# EAGLE schematic 4-voice(1_1) (EAGLE 9.2.1)

## Sheet 1 of 3
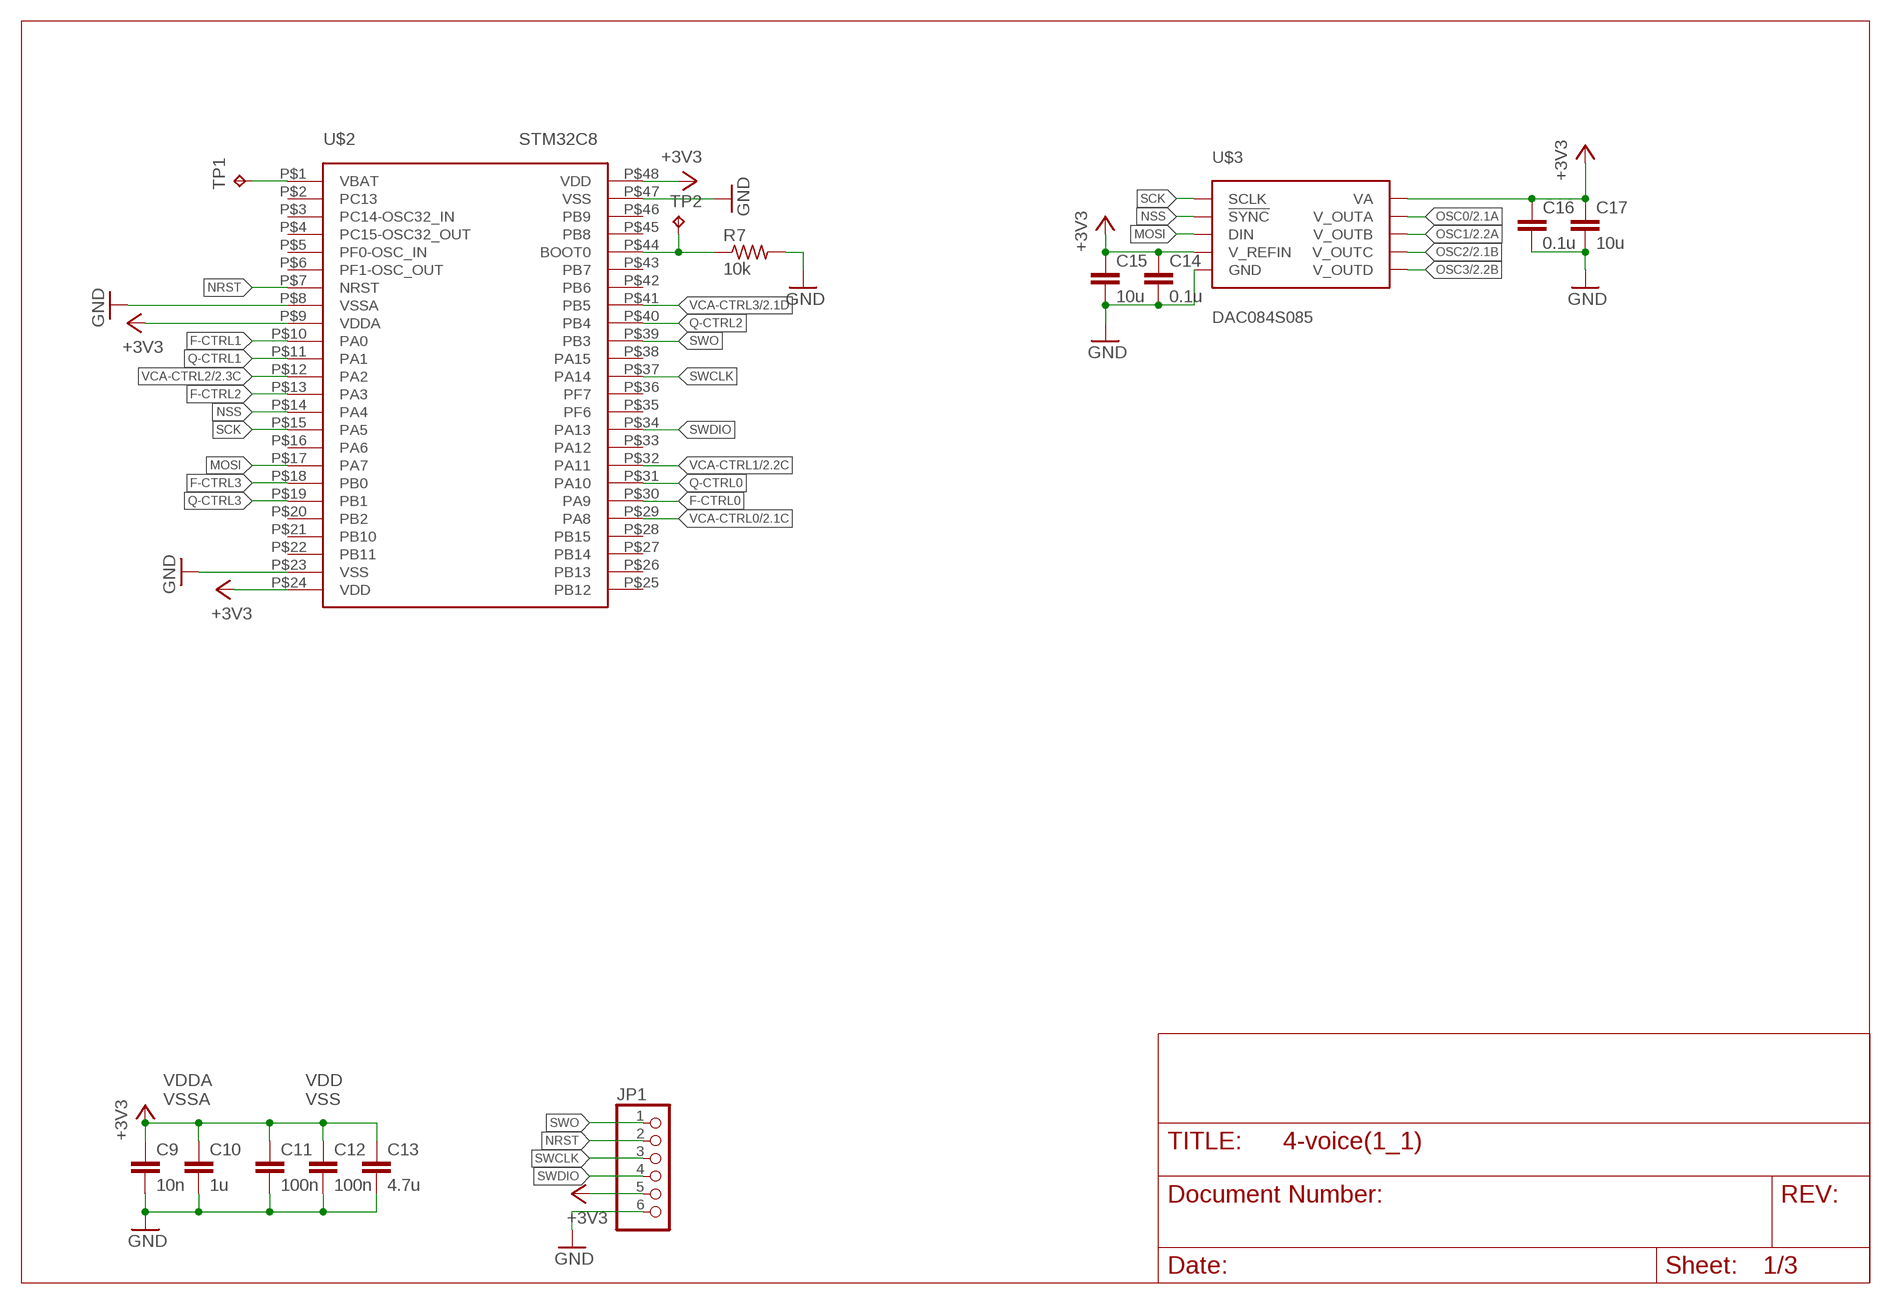
[diagram p0: schematic, sheet 1]

### Parts
C9  10n  C-EUC1206  [C1206]
C10  1u  C-EUC1206  [C1206]
C11  100n  C-EUC1206  [C1206]
C12  100n  C-EUC1206  [C1206]
C13  4.7u  C-EUC1206  [C1206]
C14  0.1u  C-EUC1206  [C1206]
C15  10u  C-EUC1206  [C1206]
C16  0.1u  C-EUC1206  [C1206]
C17  10u  C-EUC1206  [C1206]
JP1  PINHD-1X6  [1X06]
R7  10k  R-US_R1206  [R1206]
TP1  TPPAD1-13  [P1-13]
TP2  TPPAD1-13  [P1-13]
U$2  STM32C8  [LQFP48]
U$3  DAC084S085  [VSSOP10]

### Nets
+3V3: C9.1 C10.1 C11.1 C12.1 C13.1 C14.1 C15.1 C16.1 C17.1 JP1.5 U$2.P$9(VDDA) U$2.P$24(VDD) U$2.P$48(VDD) U$3.P$1(VA) U$3.P$7(V_REFIN)
F-CTRL0: U$2.P$30(PA9)
F-CTRL1: U$2.P$10(PA0)
F-CTRL2: U$2.P$13(PA3)
F-CTRL3: U$2.P$18(PB0)
GND: C9.2 C10.2 C11.2 C12.2 C13.2 C14.2 C15.2 C16.2 C17.2 JP1.6 R7.2 U$2.P$8(VSSA) U$2.P$23(VSS) U$2.P$47(VSS) U$3.P$6(GND) ; also sheet 2,3
MOSI: U$2.P$17(PA7) U$3.P$8(DIN)
N$7: TP1.TP U$2.P$1(VBAT)
N$8: R7.1 TP2.TP U$2.P$44(BOOT0)
NRST: JP1.2 U$2.P$7(NRST)
NSS: U$2.P$14(PA4) U$3.P$9(!SYNC)
OSC0: U$3.P$2(V_OUTA) ; also sheet 2
OSC1: U$3.P$3(V_OUTB) ; also sheet 2
OSC2: U$3.P$4(V_OUTC) ; also sheet 2
OSC3: U$3.P$5(V_OUTD) ; also sheet 2
Q-CTRL0: U$2.P$31(PA10)
Q-CTRL1: U$2.P$11(PA1)
Q-CTRL2: U$2.P$40(PB4)
Q-CTRL3: U$2.P$19(PB1)
SCK: U$2.P$15(PA5) U$3.P$10(SCLK)
SWCLK: JP1.3 U$2.P$37(PA14)
SWDIO: JP1.4 U$2.P$34(PA13)
SWO: JP1.1 U$2.P$39(PB3)
VCA-CTRL0: U$2.P$29(PA8) ; also sheet 2
VCA-CTRL1: U$2.P$32(PA11) ; also sheet 2
VCA-CTRL2: U$2.P$12(PA2) ; also sheet 2
VCA-CTRL3: U$2.P$41(PB5) ; also sheet 2
Unconnected: U$2.P$2(PC13) U$2.P$3(PC14-OSC32_IN) U$2.P$4(PC15-OSC32_OUT) U$2.P$5(PF0-OSC_IN) U$2.P$6(PF1-OSC_OUT) U$2.P$16(PA6) U$2.P$20(PB2) U$2.P$21(PB10) U$2.P$22(PB11) U$2.P$25(PB12) U$2.P$26(PB13) U$2.P$27(PB14) U$2.P$28(PB15) U$2.P$33(PA12) U$2.P$35(PF6) U$2.P$36(PF7) U$2.P$38(PA15) U$2.P$42(PB6) U$2.P$43(PB7) U$2.P$45(PB8) U$2.P$46(PB9)

### Notes on the sheet
- VDDA
  VSSA
- VDD
  VSS

## Sheet 2 of 3
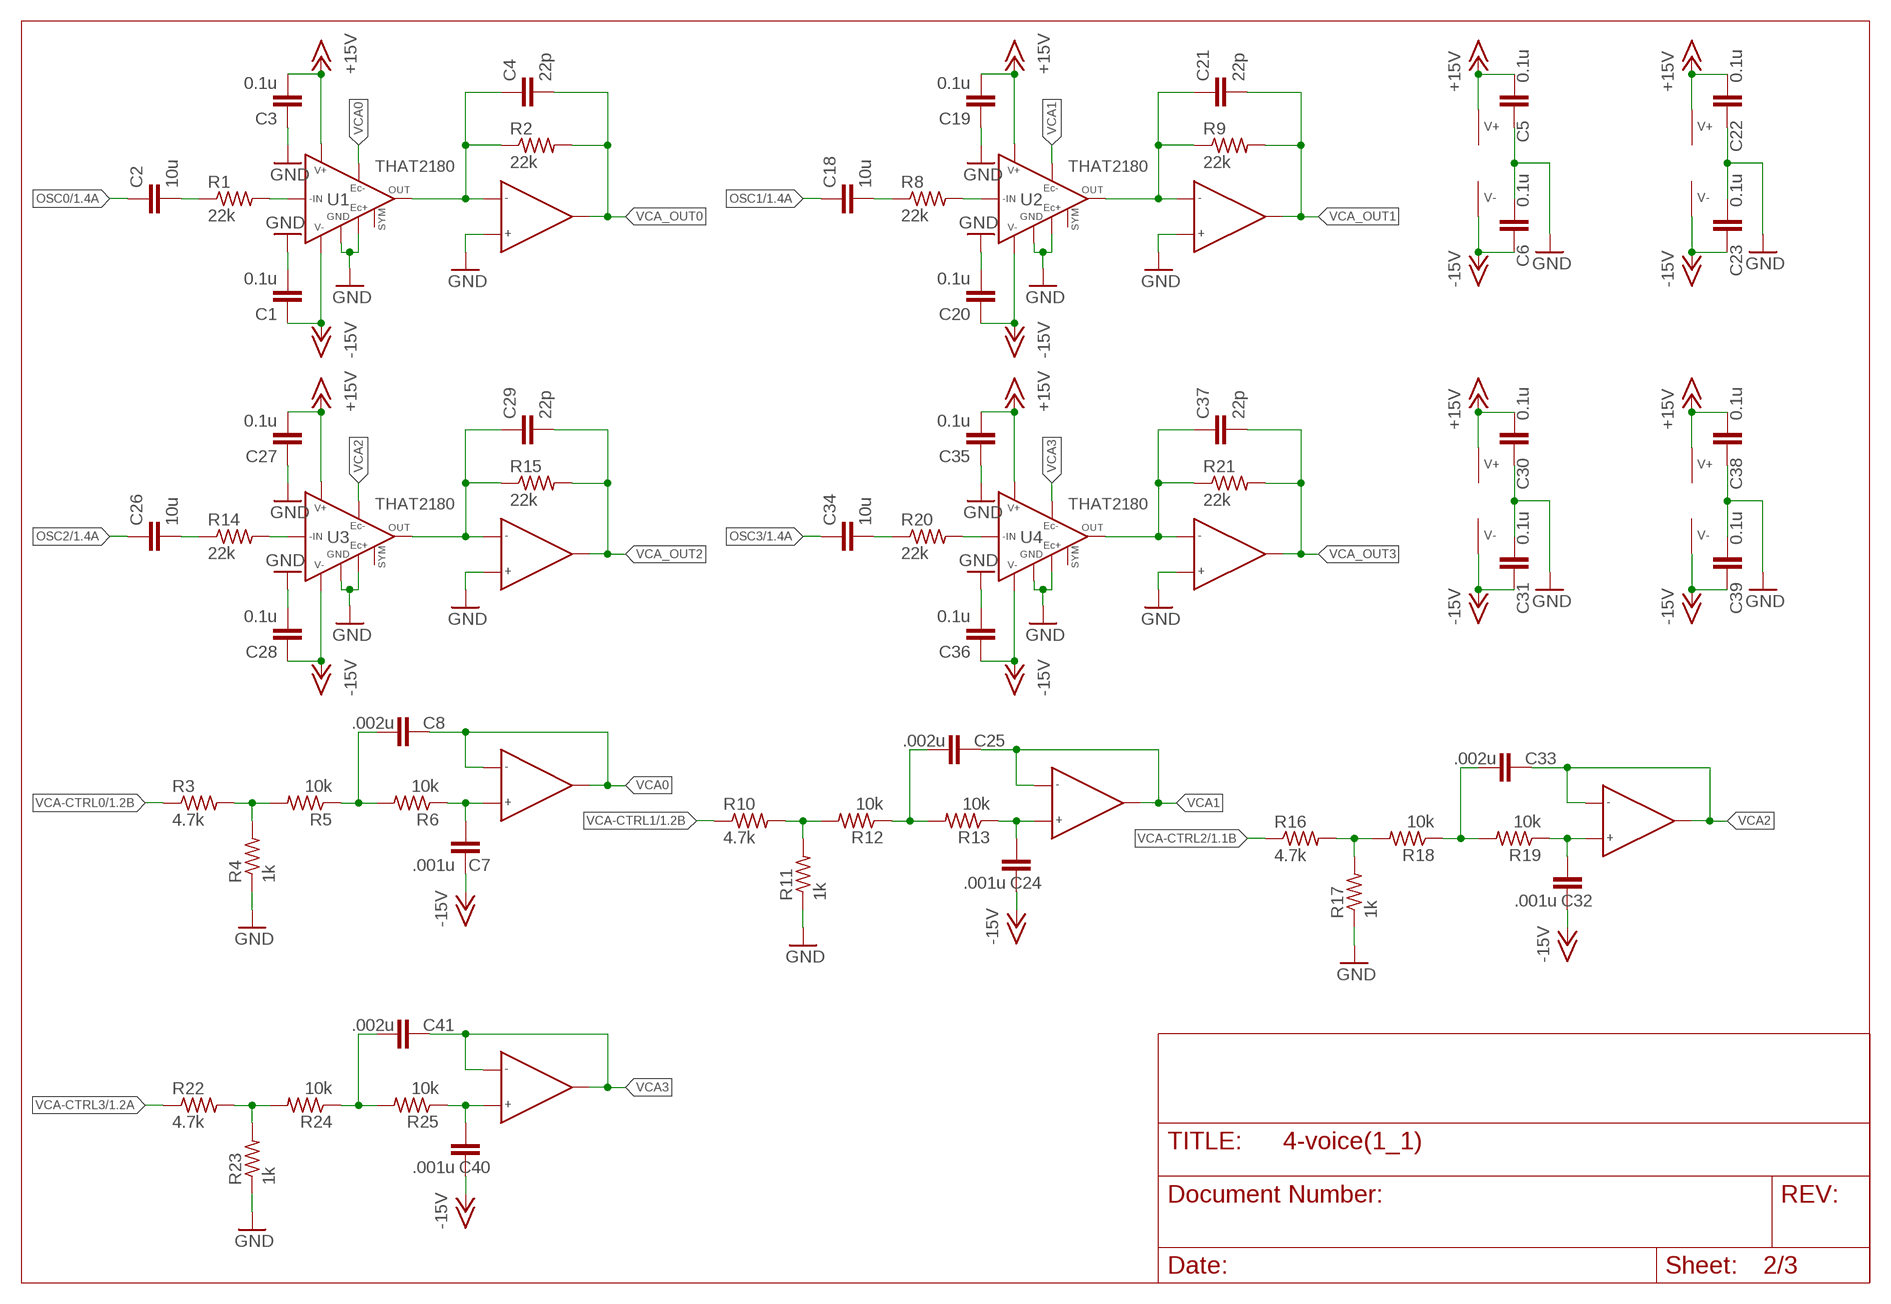
[diagram p1: schematic, sheet 2]

### Parts
C1  0.1u  C-EUC1206  [C1206]
C2  10u  C-EUC1206  [C1206]
C3  0.1u  C-EUC1206  [C1206]
C4  22p  C-EUC1206  [C1206]
C5  0.1u  C-EUC1206  [C1206]
C6  0.1u  C-EUC1206  [C1206]
C7  .001u  C-EUC1206  [C1206]
C8  .002u  C-EUC1206  [C1206]
C18  10u  C-EUC1206  [C1206]
C19  0.1u  C-EUC1206  [C1206]
C20  0.1u  C-EUC1206  [C1206]
C21  22p  C-EUC1206  [C1206]
C22  0.1u  C-EUC1206  [C1206]
C23  0.1u  C-EUC1206  [C1206]
C24  .001u  C-EUC1206  [C1206]
C25  .002u  C-EUC1206  [C1206]
C26  10u  C-EUC1206  [C1206]
C27  0.1u  C-EUC1206  [C1206]
C28  0.1u  C-EUC1206  [C1206]
C29  22p  C-EUC1206  [C1206]
C30  0.1u  C-EUC1206  [C1206]
C31  0.1u  C-EUC1206  [C1206]
C32  .001u  C-EUC1206  [C1206]
C33  .002u  C-EUC1206  [C1206]
C34  10u  C-EUC1206  [C1206]
C35  0.1u  C-EUC1206  [C1206]
C36  0.1u  C-EUC1206  [C1206]
C37  22p  C-EUC1206  [C1206]
C38  0.1u  C-EUC1206  [C1206]
C39  0.1u  C-EUC1206  [C1206]
C40  .001u  C-EUC1206  [C1206]
C41  .002u  C-EUC1206  [C1206]
R1  22k  R-US_R1206  [R1206]
R2  22k  R-US_R1206  [R1206]
R3  4.7k  R-US_R1206  [R1206]
R4  1k  R-US_R1206  [R1206]
R5  10k  R-US_R1206  [R1206]
R6  10k  R-US_R1206  [R1206]
R8  22k  R-US_R1206  [R1206]
R9  22k  R-US_R1206  [R1206]
R10  4.7k  R-US_R1206  [R1206]
R11  1k  R-US_R1206  [R1206]
R12  10k  R-US_R1206  [R1206]
R13  10k  R-US_R1206  [R1206]
R14  22k  R-US_R1206  [R1206]
R15  22k  R-US_R1206  [R1206]
R16  4.7k  R-US_R1206  [R1206]
R17  1k  R-US_R1206  [R1206]
R18  10k  R-US_R1206  [R1206]
R19  10k  R-US_R1206  [R1206]
R20  22k  R-US_R1206  [R1206]
R21  22k  R-US_R1206  [R1206]
R22  4.7k  R-US_R1206  [R1206]
R23  1k  R-US_R1206  [R1206]
R24  10k  R-US_R1206  [R1206]
R25  10k  R-US_R1206  [R1206]
U1  THAT2180  [SIP8]
U2  THAT2180  [SIP8]
U3  THAT2180  [SIP8]
U4  THAT2180  [SIP8]
U$1  TL072  [SOIC8]
U$4  TL072  [SOIC8]
U$5  TL072  [SOIC8]
U$6  TL072  [SOIC8]
U$7  TL072  [SOIC8]
U$8  TL072  [SOIC8]
U$9  TL072  [SOIC8]

### Nets
+15V: C3.2 C5.2 C19.2 C22.2 C27.2 C30.2 C35.2 C38.2 U1.$P7(V+) U2.$P7(V+) U3.$P7(V+) U4.$P7(V+) U$1.P$8(V+) U$4.P$8(V+) U$6.P$8(V+) U$8.P$8(V+) ; also sheet 3
-15V: C1.1 C6.1 C7.1 C20.1 C23.1 C24.1 C28.1 C31.1 C32.1 C36.1 C39.1 C40.1 U1.$P5(V-) U2.$P5(V-) U3.$P5(V-) U4.$P5(V-) U$1.P$4(V-) U$4.P$4(V-) U$6.P$4(V-) U$8.P$4(V-) ; also sheet 3
GND: C1.2 C3.1 C5.1 C6.2 C19.1 C20.2 C22.1 C23.2 C27.1 C28.2 C30.1 C31.2 C35.1 C36.2 C38.1 C39.2 R4.1 R11.1 R17.1 R23.1 U1.$P2(EC+) U1.$P6(GND) U2.$P2(EC+) U2.$P6(GND) U3.$P2(EC+) U3.$P6(GND) U4.$P2(EC+) U4.$P6(GND) U$1.P$3(IN+) U$4.P$3(IN+) U$5.P$3(IN+) U$7.P$3(IN+) ; also sheet 1,3
N$1: C2.2 R1.1
N$2: R1.2 U1.$P1(-IN)
N$3: C4.1 R2.1 U1.$P8(OUT) U$1.P$2(IN-)
N$4: R3.2 R4.2 R5.2
N$5: C8.2 R5.1 R6.2
N$6: C7.2 R6.1 U$1.P$5(IN+)
N$9: C18.2 R8.1
N$10: R8.2 U2.$P1(-IN)
N$11: C21.1 R9.1 U2.$P8(OUT) U$4.P$2(IN-)
N$12: R10.2 R11.2 R12.2
N$13: C25.2 R12.1 R13.2
N$14: C24.2 R13.1 U$4.P$5(IN+)
N$15: C26.2 R14.1
N$16: R14.2 U3.$P1(-IN)
N$17: C29.1 R15.1 U3.$P8(OUT) U$5.P$2(IN-)
N$18: R16.2 R17.2 R18.2
N$19: C33.2 R18.1 R19.2
N$20: C32.2 R19.1 U$6.P$5(IN+)
N$21: C34.2 R20.1
N$22: R20.2 U4.$P1(-IN)
N$23: C37.1 R21.1 U4.$P8(OUT) U$7.P$2(IN-)
N$24: R22.2 R23.2 R24.2
N$25: C41.2 R24.1 R25.2
N$26: C40.2 R25.1 U$9.P$5(IN+)
OSC0: C2.1 ; also sheet 1
OSC1: C18.1 ; also sheet 1
OSC2: C26.1 ; also sheet 1
OSC3: C34.1 ; also sheet 1
VCA0: C8.1 U1.$P3(EC-) U$1.P$6(IN-) U$1.P$7(OUT)
VCA1: C25.1 U2.$P3(EC-) U$4.P$6(IN-) U$4.P$7(OUT)
VCA2: C33.1 U3.$P3(EC-) U$6.P$6(IN-) U$6.P$7(OUT)
VCA3: C41.1 U4.$P3(EC-) U$9.P$6(IN-) U$9.P$7(OUT)
VCA-CTRL0: R3.1 ; also sheet 1
VCA-CTRL1: R10.1 ; also sheet 1
VCA-CTRL2: R16.1 ; also sheet 1
VCA-CTRL3: R22.1 ; also sheet 1
VCA_OUT0: C4.2 R2.2 U$1.P$1(OUT)
VCA_OUT1: C21.2 R9.2 U$4.P$1(OUT)
VCA_OUT2: C29.2 R15.2 U$5.P$1(OUT)
VCA_OUT3: C37.2 R21.2 U$7.P$1(OUT)
Unconnected: U1.$P4(SYM) U2.$P4(SYM) U3.$P4(SYM) U4.$P4(SYM) U$5.P$4(V-) U$5.P$5(IN+) U$5.P$6(IN-) U$5.P$7(OUT) U$5.P$8(V+) U$6.P$1(OUT) U$6.P$2(IN-) U$6.P$3(IN+) U$7.P$4(V-) U$7.P$5(IN+) U$7.P$6(IN-) U$7.P$7(OUT) U$7.P$8(V+) U$8.P$1(OUT) U$8.P$2(IN-) U$8.P$3(IN+) U$8.P$5(IN+) U$8.P$6(IN-) U$8.P$7(OUT) U$9.P$1(OUT) U$9.P$2(IN-) U$9.P$3(IN+) U$9.P$4(V-) U$9.P$8(V+)

## Sheet 3 of 3
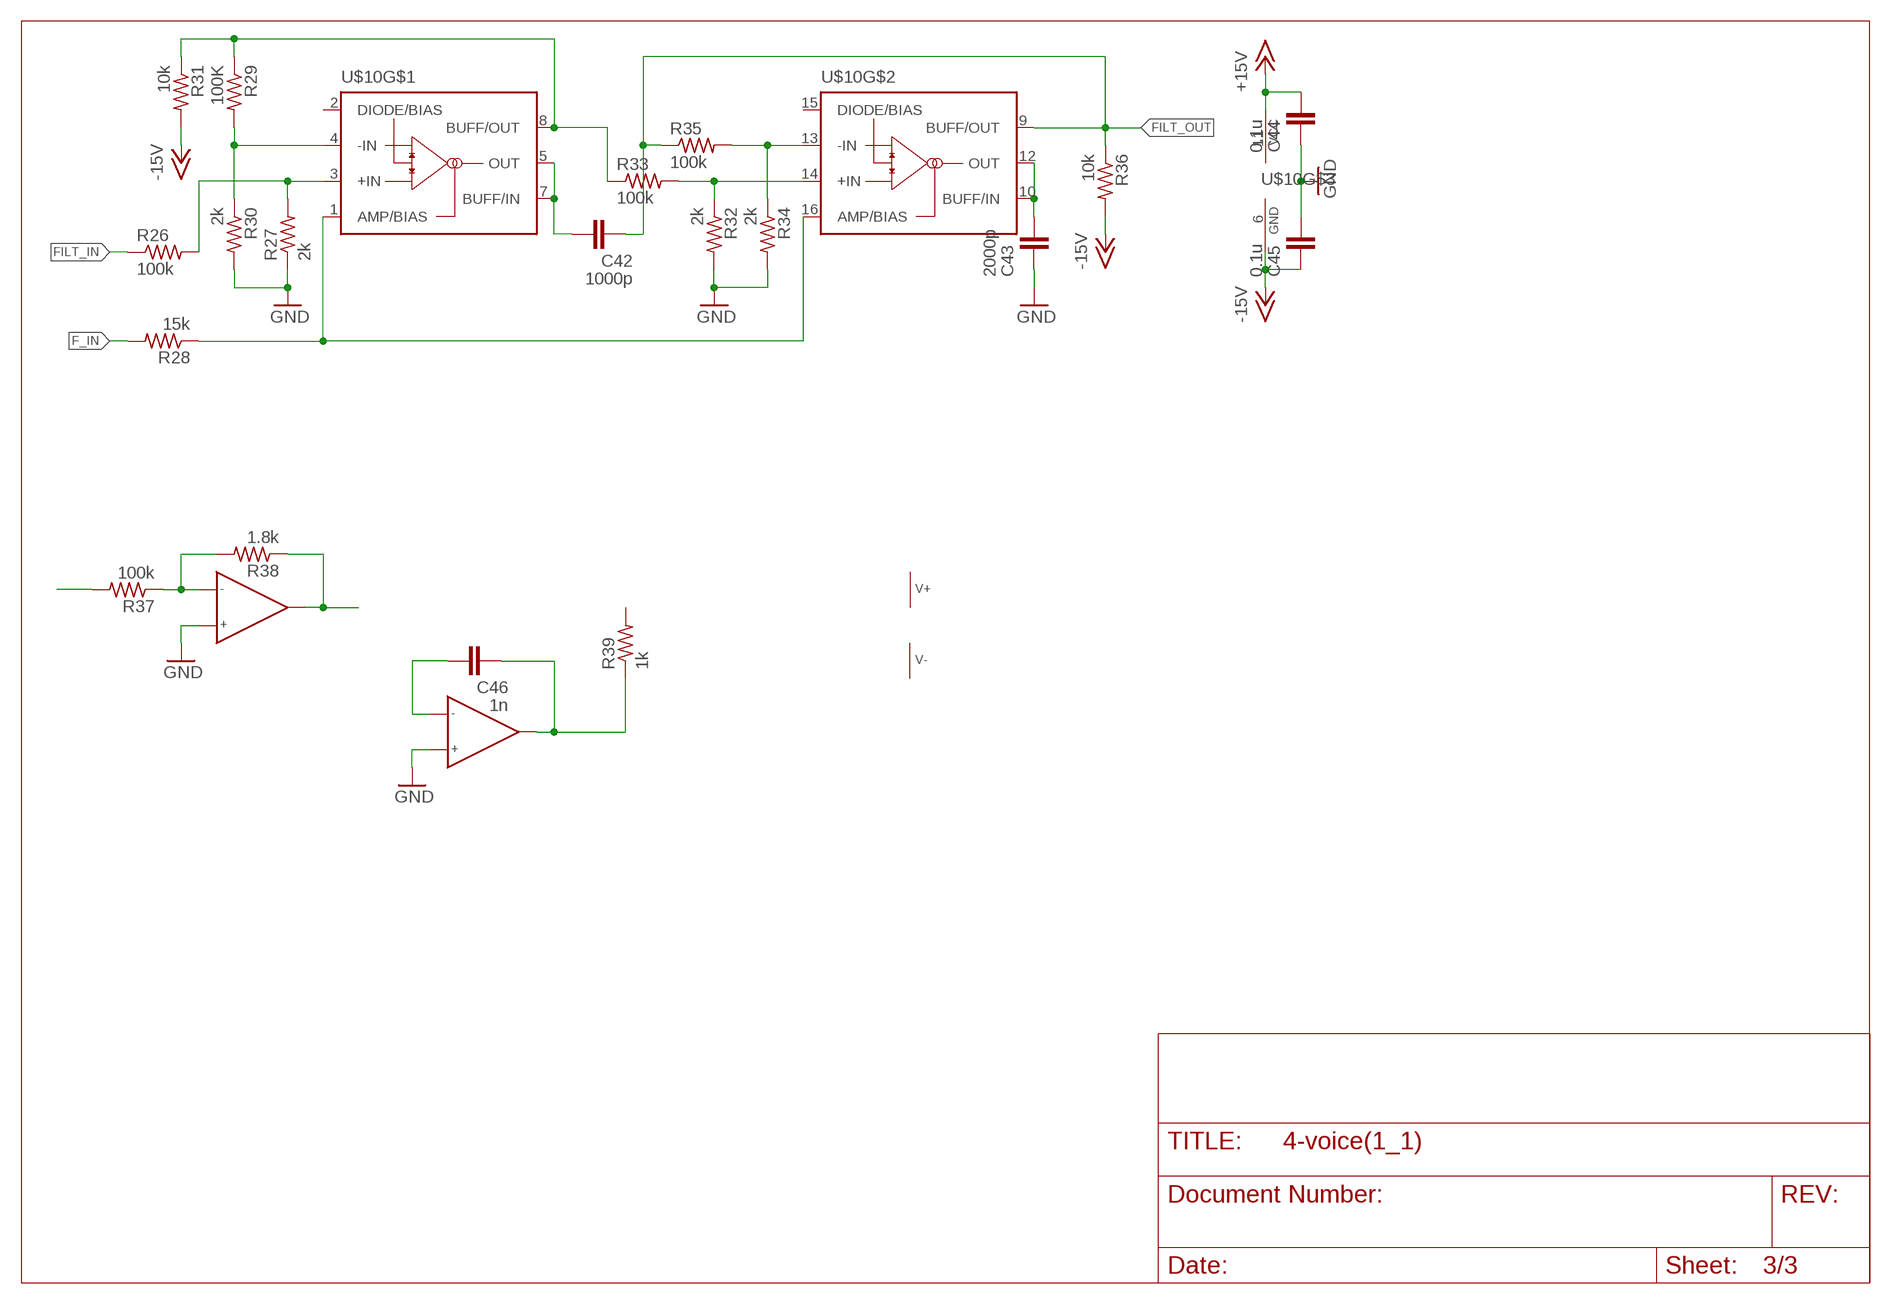
[diagram p2: schematic, sheet 3]

### Parts
C42  1000p  C-EUC1206  [C1206]
C43  2000p  C-EUC1206  [C1206]
C44  0.1u  C-EUC1206  [C1206]
C45  0.1u  C-EUC1206  [C1206]
C46  1n  C-EUC1206  [C1206]
R26  100k  R-US_R1206  [R1206]
R27  2k  R-US_R1206  [R1206]
R28  15k  R-US_R1206  [R1206]
R29  100K  R-US_R1206  [R1206]
R30  2k  R-US_R1206  [R1206]
R31  10k  R-US_R1206  [R1206]
R32  2k  R-US_R1206  [R1206]
R33  100k  R-US_R1206  [R1206]
R34  2k  R-US_R1206  [R1206]
R35  100k  R-US_R1206  [R1206]
R36  10k  R-US_R1206  [R1206]
R37  100k  R-US_R1206  [R1206]
R38  1.8k  R-US_R1206  [R1206]
R39  1k  R-US_R1206  [R1206]
U$10  XX-13700DMP16  [DMP16]
U$11  TL072  [SOIC8]

### Nets
+15V: C44.1 U$10.11(VCC) ; also sheet 2
-15V: C45.2 R31.2 R36.2 U$10.6(GND) ; also sheet 2
F_IN: R28.2
FILT_IN: R26.1
FILT_OUT: C42.2 R35.1 R36.1 U$10.9(BUFF/OUT)
GND: C43.2 C44.2 C45.1 R27.1 R30.2 R32.2 R34.2 U$11.P$3(IN+) U$11.P$5(IN+) ; also sheet 1,2
N$27: R26.2 R27.2 U$10.3(+IN)
N$28: R28.1 U$10.1(AMP/BIAS) U$10.16(AMP/BIAS)
N$29: R37.1 R38.2 U$11.P$2(IN-)
N$30: R37.2
N$31: R29.2 R30.1 U$10.4(-IN)
N$32: C42.1 U$10.5(OUT) U$10.7(BUFF/IN)
N$33: R29.1 R31.1 R33.1 U$10.8(BUFF/OUT)
N$34: C43.1 U$10.10(BUFF/IN) U$10.12(OUT)
N$35: R32.1 R33.2 U$10.14(+IN)
N$36: R34.1 R35.2 U$10.13(-IN)
N$37: R38.1 U$11.P$1(OUT)
N$38: C46.2 R39.1 U$11.P$7(OUT)
N$39: C46.1 U$11.P$6(IN-)
Unconnected: R39.2 U$10.2(DIODE/BIAS) U$10.15(DIODE/BIAS) U$11.P$4(V-) U$11.P$8(V+)

## Library data of the parts
C1-C41 = rcl:C-EU: CAPACITOR, European symbol; SPICEPREFIX: C
C42-C46 = resistor:C-EU: CAPACITOR, European symbol
JP1 = pinhead:PINHD-1X6: PIN HEADER
R1-R25 = rcl:R-US_: RESISTOR, American symbol; SPICEPREFIX: R
R26-R39 = resistor:R-US_: RESISTOR, American symbol
TP1 TP2 = testpad:TP: Test pad
U1-U4 = synth:THAT2180
U$1 U$5 U$7 U$11 = synth:TL072
U$2 = synth:STM32C8
U$3 = synth:DAC084S085
U$4 = synth:TL072; SPICEPREFIX: J
U$6 U$8 U$9 = synth:TL072; SPICEPREFIX: B
U$10 = LITTLEBITS:XX-13700